# Altium project UZ_PER_SiC_inverter_828xcc.PrjPCB (part 1 of 2)
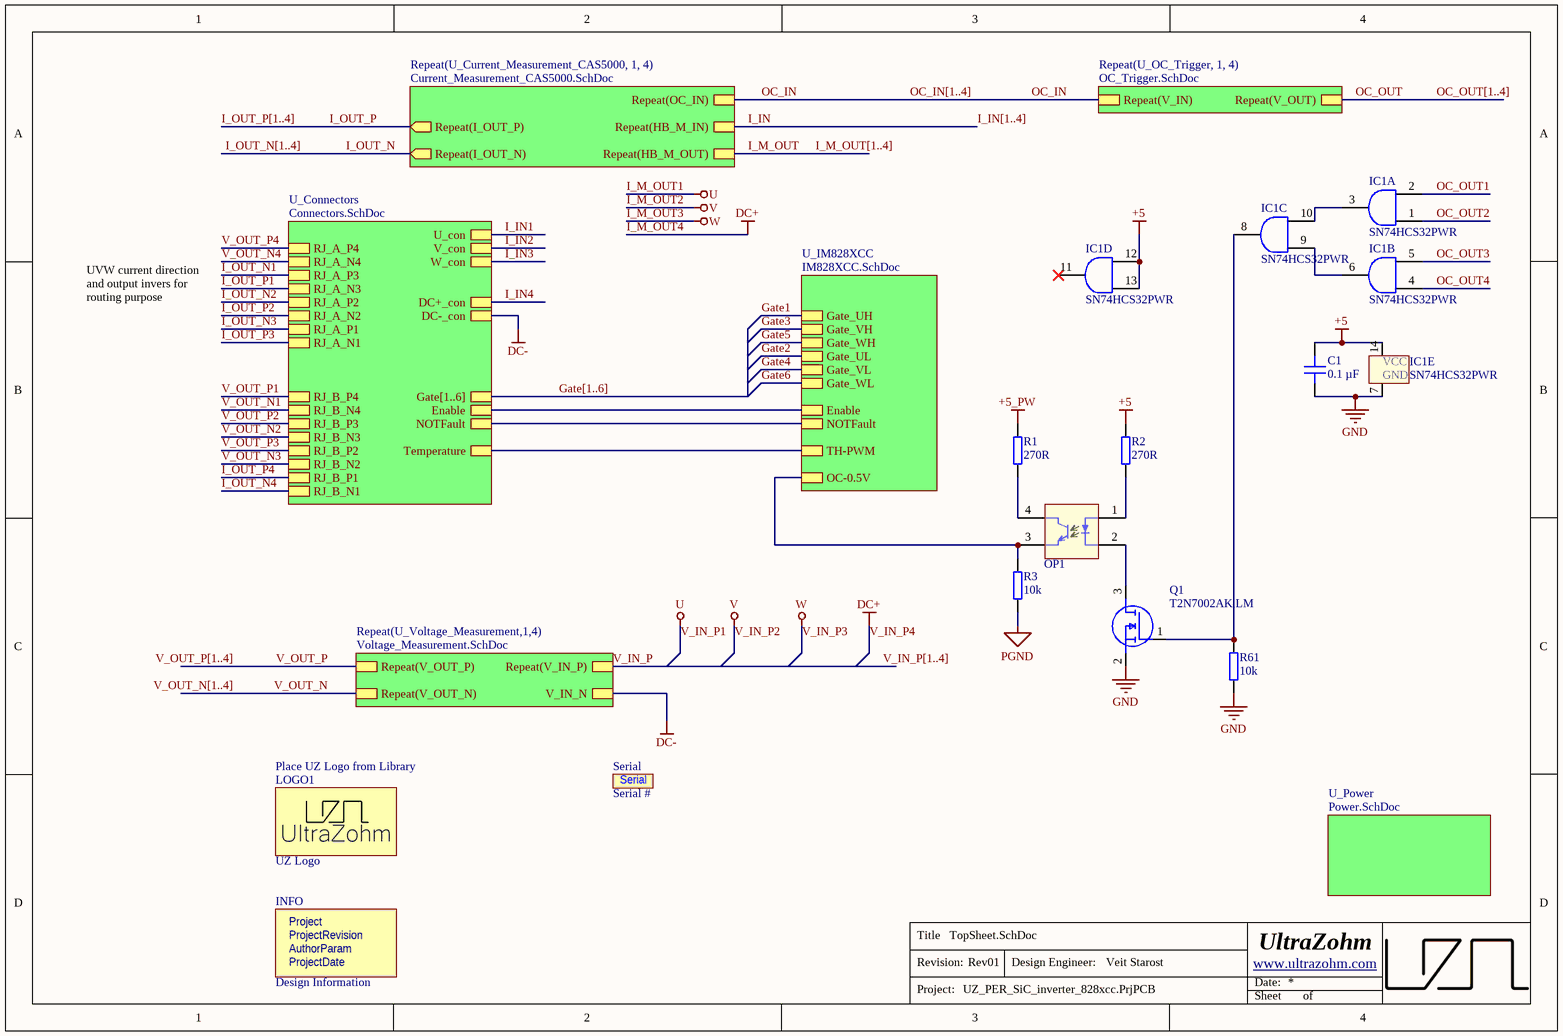
[diagram p0: TopSheet.SchDoc]
Author: Veit Starost; AuthorParam: Veit Starost; Project: UZ_PER_SiC_inverter_828xcc; ProjectDate: 02/2023; ProjectRevision: Rev01
9 sheets, 389 parts. Net scope: hierarchical (ports join the sheet entries above them; power ports are global).
Board file: UZ_PER_SiC_inverter_828xcc.PcbDoc
Sheets:
  TopSheet.SchDoc
    U_Power = Power.SchDoc
    U_IM828XCC = IM828XCC.SchDoc
    U_Current_Measurement_CAS50001 = Current_Measurement_CAS5000.SchDoc
    U_Current_Measurement_CAS50002 = Current_Measurement_CAS5000.SchDoc
    U_Current_Measurement_CAS50003 = Current_Measurement_CAS5000.SchDoc
    U_Current_Measurement_CAS50004 = Current_Measurement_CAS5000.SchDoc
    U_Connectors = Connectors.SchDoc
      Opt_RX_gate1 = Optical_RX.SchDoc
      Opt_RX_gate2 = Optical_RX.SchDoc
      Opt_RX_gate3 = Optical_RX.SchDoc
      Opt_RX_gate4 = Optical_RX.SchDoc
      Opt_RX_gate5 = Optical_RX.SchDoc
      Opt_RX_gate6 = Optical_RX.SchDoc
      Opt_TX_Fault = Optical_TX.SchDoc
      Opt_TX_Temp = Optical_TX.SchDoc
      Opt_RX_en = Optical_RX.SchDoc
    U_Voltage_Measurement1 = Voltage_Measurement.SchDoc
    U_Voltage_Measurement2 = Voltage_Measurement.SchDoc
    U_Voltage_Measurement3 = Voltage_Measurement.SchDoc
    U_Voltage_Measurement4 = Voltage_Measurement.SchDoc
    U_OC_Trigger1 = OC_Trigger.SchDoc
    U_OC_Trigger2 = OC_Trigger.SchDoc
    U_OC_Trigger3 = OC_Trigger.SchDoc
    U_OC_Trigger4 = OC_Trigger.SchDoc

## Sheet TopSheet.SchDoc
size A4; Author: Veit Starost; CompanyName: Technische Hochschule Nürnberg Georg Simon Ohm; Organization: UltraZohm; Address1: Kesslerplatz 12; Address2: 90489 Nürnberg; Address3: GERMANY; Website: www.ultrazohm.com

### Parts
C1  0.1 µF  [C_0603]
IC1  SN74HCS32PWR  [TSSOP-14]  (parts A,B,C,D,E of 5)
INFO  Design Information  [Design_info]  (no BOM)
LOGO1  UZ Logo  [UZ_Logo_small]  (no BOM)
OP1  VO617A-2X017T  [SMD4]  (value not drawn)
Q1  T2N7002AK,LM  [SOT-23-3]
R1  270R  [RES 0603_1608]
R2  270R  [RES 0603_1608]
R3  10k  [RES 0603_1608]
R61  10k  [RES 0603_1608]
Serial  Serial #  [SERIAL]  (no BOM)

### Sub-sheets
Repeat(U_Current_Measurement_CAS5000, 1, 4) = Current_Measurement_CAS5000.SchDoc: Repeat(HB_M_IN), Repeat(HB_M_OUT), Repeat(I_OUT_P) (out), Repeat(I_OUT_N) (out), Repeat(OC_IN)
Repeat(U_OC_Trigger, 1, 4) = OC_Trigger.SchDoc: Repeat(V_IN), Repeat(V_OUT)
Repeat(U_Voltage_Measurement,1,4) = Voltage_Measurement.SchDoc: Repeat(V_IN_P), V_IN_N, Repeat(V_OUT_N), Repeat(V_OUT_P)
U_Connectors = Connectors.SchDoc: Gate[1..6], Enable, Temperature, NOTFault, RJ_A_P4, RJ_A_N4, RJ_A_P3, RJ_A_N3, RJ_A_P2, RJ_A_N2, RJ_A_P1, RJ_A_N1, RJ_B_P4, RJ_B_N4, RJ_B_P3, RJ_B_N3, RJ_B_P2, RJ_B_N2, RJ_B_P1, RJ_B_N1, DC+_con, DC-_con, U_con, V_con, W_con
U_IM828XCC = IM828XCC.SchDoc: Gate_UL, Gate_VL, Gate_WL, Gate_WH, Gate_VH, Gate_UH, OC-0.5V, Enable, NOTFault, TH-PWM
U_Power = Power.SchDoc: no entries

### Nets
+5: C1.2 IC1.12 IC1.13 IC1.14 R2.2
+5_PW: R1.2
DC-: sheet U_Connectors/DC-_con, sheet Repeat(U_Voltage_Measurement,1,4)/V_IN_N
GND: C1.1 IC1.7 Q1.2(S) R61.1
PGND: R3.1
I_IN: sheet Repeat(U_Current_Measurement_CAS5000, 1, 4)/Repeat(HB_M_IN)
I_M_OUT: sheet Repeat(U_Current_Measurement_CAS5000, 1, 4)/Repeat(HB_M_OUT)
I_OUT_N: sheet Repeat(U_Current_Measurement_CAS5000, 1, 4)/Repeat(I_OUT_N)
I_OUT_P: sheet Repeat(U_Current_Measurement_CAS5000, 1, 4)/Repeat(I_OUT_P)
OC_IN: sheet Repeat(U_Current_Measurement_CAS5000, 1, 4)/Repeat(OC_IN), sheet Repeat(U_OC_Trigger, 1, 4)/Repeat(V_IN)
OC_OUT: sheet Repeat(U_OC_Trigger, 1, 4)/Repeat(V_OUT)
OC_OUT1: IC1.2
OC_OUT2: IC1.1
OC_OUT3: IC1.5
OC_OUT4: IC1.4
V_IN_P: sheet Repeat(U_Voltage_Measurement,1,4)/Repeat(V_IN_P)
V_OUT_N: sheet Repeat(U_Voltage_Measurement,1,4)/Repeat(V_OUT_N)
V_OUT_P: sheet Repeat(U_Voltage_Measurement,1,4)/Repeat(V_OUT_P)
NetC36_2: OP1.3 R3.2 ; sheet U_IM828XCC/OC-0.5V
NetIC1_3: IC1.3 IC1.10
NetIC1_6: IC1.6 IC1.9
NetIC1_8: IC1.8 Q1.1(G) R61.2
NetIC6_6: sheet U_IM828XCC/TH-PWM, sheet U_Connectors/Temperature
NetIC10G_4: sheet U_IM828XCC/Enable, sheet U_Connectors/Enable
NetIC11A_2: sheet U_IM828XCC/NOTFault, sheet U_Connectors/NOTFault
NetOP1_1: OP1.1 R2.1
NetOP1_2: OP1.2 Q1.3(D)
NetOP1_4: OP1.4 R1.1

Not connected (* = marked no-connect by the designer): IC1 11*

### Buses and harness runs
bus Gate[1..6] = sheet U_Connectors/Gate[1..6]
bus I_IN[1..4]
bus I_M_OUT[1..4]
bus I_OUT_N[1..4]
bus I_OUT_P[1..4]
bus OC_IN[1..4]
bus OC_OUT[1..4]
bus V_IN_P[1..4]
bus V_OUT_N[1..4]
bus V_OUT_P[1..4]

### Notes on the sheet
- UVW current direction and output invers for routing purpose
- (near LOGO1) Place UZ Logo from Library
- Title
- Revision:
- Design Engineer:
- Date:
- Project:
- Sheet
- of
- (in symbol Design Information) Project; ProjectRevision; AuthorParam; ProjectDate
- (in symbol SN74HCS32PWR, part E) VCC; GND

### Library data of the parts
C1 = C0603X104K5RAC7411: Capacitor 0603, 50 VDC, 0.1 µF, X7R; Manufacturer: KEMET; Tolerance: 10 %; Voltage Rating: 50 VDC; Created from: MGremer; Manufacturer Part Number: C0603X104K5RAC7411; PartID: 3; Created On: 20.12.2020 13:54:13; ComponentLink1Description: Datasheet; ComponentLink1URL: https://www.mouser.de/datasheet/2/212/1/KEM_C1013_X7R_FT_CAP_SMD-1103280.pdf; Component Type: Capacitor 0603; Device Package: 0603; Last Updated: 04.03.2021 09:24:28; Mounting Type: SMD; Operating Temperature: -55 - 125°C; Series: SMD Comm X7R Flex; Supplier 1: Mouser; Supplier Part Number 1: 80-C0603X104K5R7411; Supplier 2: LCSC; Supplier Part Number 2: C14663; Type: Capacitor; Value: 0.1 µF; Live Cycle Status: 1; LCSC Part Number: C14663; Stock number: Labor SMD Container
IC1 = SN74HCS32PWR: Logische Gatter Quadruple 2-input OR gates with Schmitt-trigger inputs 14-TSSOP -40 to 125; Manufacturer: Texas Instruments; Value: 6 V; Created from: VStarost; Manufacturer Part Number: SN74HCS32PWR; PartID: 5; Created On: 31.01.2023 11:53:14; ComponentLink1Description: Datasheet; ComponentLink1URL: https://www.ti.com/lit/ds/symlink/sn74hcs32.pdf?HQS=dis-mous-null-mousermode-dsf-pf-null-wwe&ts=1675161071566&ref_url=https%253A%252F%252Fwww.mouser.de%252F; Component Type: OR; Device Package: TSSOP-14; Last Updated: 31.01.2023 11:53:14; Mounting Type: SMD; Operating Temperature: -40 - 125 °C; Series: SN74HCS32; Supplier 1: Mouser; Supplier Part Number 1: 595-SN74HCS32PWR; Type: OR; Live Cycle Status: 1; Stock number: not stored
INFO = Design Information: Manufacturer: UltraZohm; Created from: MGremer; Manufacturer Part Number: Design Information; PartID: 12; Created On: 03.11.2021 09:04:23; ComponentLink1Description: https://docs.ultrazohm.com/; ComponentLink1URL: homepage; Component Type: Design Information; Last Updated: 03.11.2021 09:28:34; Supplier 1: -; Supplier Part Number 1: -; Type: Design Information; Value: Design Information; Live Cycle Status: 1
LOGO1 = Logo small: Manufacturer: UltraZohm; Created from: MGremer; Created: Jan2021_Liegmann; Value: Logo; Manufacturer Part Number: Logo small; PartID: 10; Created On: 03.11.2021 09:04:23; ComponentLink1Description: https://docs.ultrazohm.com/; ComponentLink1URL: homepage; Component Type: Logo; Last Updated: 03.11.2021 09:05:50; Supplier 1: -; Supplier Part Number 1: -; Type: Logo; Live Cycle Status: 1
OP1 = VO617A-2X017T: Transistor-Ausgangsoptokoppler H. Relblty 5300 Vrms 63-125% CTR, VDE; Manufacturer: Vishay; Channels: 1; Created from: VStarost; Manufacturer Part Number: VO617A-2X017T; PartID: 4; Created On: 31.01.2023 09:27:11; ComponentLink1Description: Datasheet; ComponentLink1URL: https://www.mouser.de/datasheet/2/427/vo617a-1766974.pdf; Component Type: Optokoppler; Last Updated: 31.01.2023 09:27:11; Mounting Type: SMD; Operating Temperature: -55 - +110 °C; Supplier 1: Mouser; Supplier Part Number 1: 78-VO617A-2X017T; Type: Optokoppler; Live Cycle Status: 1
Q1 = T2N7002AK,LM: Small-signal MOSFET, n-Channel, 200 mA, 60 V; Manufacturer: Toshiba; Type: Power MOSFET; Value: 60 V; Created from: VStarost; Manufacturer Part Number: T2N7002AK,LM; PartID: 4; Created On: 24.01.2023 08:00:45; ComponentLink1Description: Datasheet; ComponentLink1URL: https://toshiba.semicon-storage.com/info/T2N7002AK_datasheet_en_20150401.pdf?did=29712&prodName=T2N7002AK; Component Type: Small-signal MOSFET; Device Package: SOT-23-3; Last Updated: 15.02.2023 18:16:19; Mounting Type: SMD; Operating Temperature: -55 - 150 °C; Series: T2N7002; Supplier 1: Mouser; Supplier Part Number 1: 757-T2N7002AKLM; Supplier 2: Digi-Key; Supplier Part Number 2: T2N7002AKLMCT-ND; Live Cycle Status: 1; Stock number: not stored; LCSC Part Number: C516175
R1 R2 = RK73B1JTTDD271J: SMD resistor E24 series; Manufacturer: KOA Speer; Tolerance: 5%; Created from: MGremer; Manufacturer Part Number: RK73B1JTTDD271J; PartID: 60; Created On: 14.12.2020 16:17:14; ComponentLink1Description: Datasheet; ComponentLink1URL: https://www.mouser.de/datasheet/2/219/RK73B-1825463.pdf; Component Type: SMD resistor; Device Package: 0603; Last Updated: 15.02.2023 17:43:45; Mounting Type: SMD; Supplier 1: Mouser; Supplier Part Number 1: 660-RK73B1JTTDD271J; Type: Resistor; Value: 270R; Live Cycle Status: 1; Stock number: Labor SMD Container; LCSC Part Number: C177305
R3 R61 = MCWR06X1002FTL: SMD resistor 1%; Manufacturer: Multicomp PRO; Created from: MGremer; Manufacturer Part Number: MCWR06X1002FTL; PartID: 176; Created On: 14.12.2020 16:17:14; ComponentLink1Description: Datasheet; ComponentLink1URL: http://www.farnell.com/datasheets/2860681.pdf; Component Type: SMD resistor; Device Package: 0603; Last Updated: 15.02.2023 17:53:17; Mounting Type: SMD; Supplier 1: Farnell; Supplier Part Number 1: 2447230; Type: Resistor; Tolerance: 1%; Value: 10k; Live Cycle Status: 1; Stock number: not stored; LCSC Part Number: C269701
Serial = SerialNumber: Empty serial number of the PCB. Can be used for manually writing the serial number

## Sheet Power.SchDoc
size A4; Author: Veit Starost; CompanyName: Technische Hochschule Nürnberg Georg Simon Ohm; Organization: UltraZohm; Address1: Kesslerplatz 12; Address2: 90489 Nürnberg; Address3: GERMANY; Website: www.ultrazohm.com
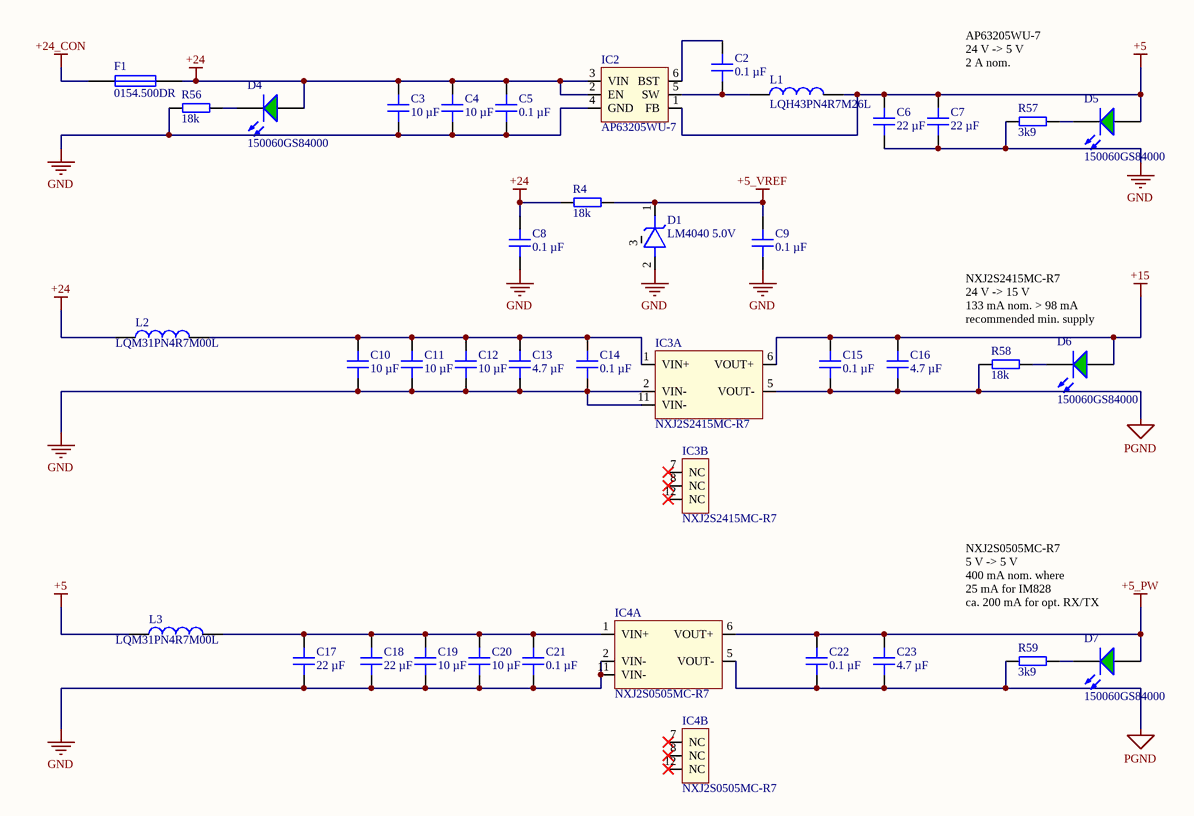
[diagram p1: Power.SchDoc]

### Parts
C2  0.1 µF  [C_0603]
C3  10 µF  [C_1206]
C4  10 µF  [C_1206]
C5  0.1 µF  [C_0603]
C6  22 µF  [C_1206]
C7  22 µF  [C_1206]
C8  0.1 µF  [C_0603]
C9  0.1 µF  [C_0603]
C10  10 µF  [C_1206]
C11  10 µF  [C_1206]
C12  10 µF  [C_1206]
C13  4.7 µF  [C_0805]
C14  0.1 µF  [C_0603]
C15  0.1 µF  [C_0603]
C16  4.7 µF  [C_0805]
C17  22 µF  [C_1206]
C18  22 µF  [C_1206]
C19  10 µF  [C_1206]
C20  10 µF  [C_1206]
C21  0.1 µF  [C_0603]
C22  0.1 µF  [C_0603]
C23  4.7 µF  [C_0805]
D1  LM4040 5.0V  [SOT-23-3]
D4  150060GS84000  [WL-SMCW_0603]
D5  150060GS84000  [WL-SMCW_0603]
D6  150060GS84000  [WL-SMCW_0603]
D7  150060GS84000  [WL-SMCW_0603]
F1  0154.500DR  [Littlefuse_154]
IC2  AP63205WU-7  [TSOT26-6]
IC3  NXJ2S2415MC-R7  [DCDC]  (parts A,B of 2)
IC4  NXJ2S0505MC-R7  [DCDC]  (parts A,B of 2)
L1  LQH43PN4R7M26L  [IND]
L2  LQM31PN4R7M00L  [IND 1206_3216]
L3  LQM31PN4R7M00L  [IND 1206_3216]
R4  18k  [RES 0603_1608]
R56  18k  [RES 0603_1608]
R57  3k9  [RES 0603_1608]
R58  18k  [RES 0603_1608]
R59  3k9  [RES 0603_1608]

### Nets
+5: C6.2 C7.2 D5.2(A) IC2.1(FB) L1.2 L3.1
+5_PW: C22.2 C23.2 D7.2(A) IC4.6(VOUT+)
+5_VREF: C9.2 D1.1(K) R4.2
+15: C15.2 C16.2 D6.2(A) IC3.6(VOUT+)
+24: C3.2 C4.2 C5.2 C8.2 D4.2(A) F1.2 IC2.2(EN) IC2.3(VIN) L2.1 R4.1
+24_CON: F1.1
GND: C3.1 C4.1 C5.1 C6.1 C7.1 C8.1 C9.1 C10.1 C11.1 C12.1 C13.1 C14.1 C17.1 C18.1 C19.1 C20.1 C21.1 D1.2(A) IC2.4(GND) IC3.2(VIN-) IC3.11(VIN-) IC4.2(VIN-) IC4.11(VIN-) R56.1 R57.1
PGND: C15.1 C16.1 C22.1 C23.1 IC3.5(VOUT-) IC4.5(VOUT-) R58.1 R59.1
NetC2_1: C2.1 IC2.5(SW) L1.1
NetC2_2: C2.2 IC2.6(BST)
NetC10_2: C10.2 C11.2 C12.2 C13.2 C14.2 IC3.1(VIN+) L2.2
NetC17_2: C17.2 C18.2 C19.2 C20.2 C21.2 IC4.1(VIN+) L3.2
NetD4_1: D4.1(K) R56.2
NetD5_1: D5.1(K) R57.2
NetD6_1: D6.1(K) R58.2
NetD7_1: D7.1(K) R59.2

Not connected (* = marked no-connect by the designer): D1 3(NC); IC3 7(NC)* 8(NC)* 12(NC)*; IC4 7(NC)* 8(NC)* 12(NC)*

### Notes on the sheet
- AP63205WU-7
  24 V -> 5 V
  2 A nom.
- NXJ2S2415MC-R7
  24 V -> 15 V
  133 mA nom. > 98 mA
  recommended min. supply
- NXJ2S0505MC-R7
  5 V -> 5 V
  400 mA nom. where
  25 mA for IM828
  ca. 200 mA for opt. RX/TX
- Title
- Revision:
- Design Engineer:
- Date:
- Project:
- Sheet
- of

### Library data of the parts
C2 C5 C8 C9 C14 C15 C21 C22 = C0603X104K5RAC7411: as C1 on sheet TopSheet; Manufacturer Part Number: C0603X104K5RAC7411; PartID: 3; Created On: 20.12.2020 13:54:13; ComponentLink1Description: Datasheet; ComponentLink1URL: https://www.mouser.de/datasheet/2/212/1/KEM_C1013_X7R_FT_CAP_SMD-1103280.pdf; Component Type: Capacitor 0603; Device Package: 0603; Last Updated: 04.03.2021 09:24:28; Mounting Type: SMD; Operating Temperature: -55 - 125°C; Series: SMD Comm X7R Flex; Supplier 1: Mouser; Supplier Part Number 1: 80-C0603X104K5R7411; Supplier 2: LCSC; Supplier Part Number 2: C14663; Type: Capacitor; Value: 0.1 µF; Live Cycle Status: 1; LCSC Part Number: C14663; Stock number: Labor SMD Container
C3 C4 C10-C12 C19 C20 = CGA5L1X7R1H106K160AC: Capacitor 1206, 50 VDC, 10 µF, X7R; Manufacturer: TDK; Tolerance: 10 %; Voltage Rating: 50 VDC; Created from: MGremer; Manufacturer Part Number: CGA5L1X7R1H106K160AC; PartID: 25; Created On: 20.12.2020 13:54:13; ComponentLink1Description: Datasheet; ComponentLink1URL: https://product.tdk.com/info/en/catalog/datasheets/mlcc_automotive_general_en.pdf; Component Type: Capacitor 1206; Device Package: 1206; Last Updated: 27.05.2022 14:15:21; Mounting Type: SMD; Operating Temperature: -55 - 125°C; Series: CGA; Supplier 1: Mouser; Supplier Part Number 1: 810-CGA5L1X7R1H106K1; Type: Capacitor; Value: 10 µF; Live Cycle Status: 1; LCSC Part Number: C13585; Stock number: Labor SMD Container
C6 C7 C17 C18 = C3216X5R1V226M160AC: Capacitor 1206, 35 VDC, 22µF, X5R; Manufacturer: TDK; Tolerance: 20 %; Voltage Rating: 35 VDC; Created from: VStarost; Manufacturer Part Number: C3216X5R1V226M160AC; PartID: 116; Created On: 14.12.2022 12:32:58; ComponentLink1Description: Datasheet; ComponentLink1URL: https://product.tdk.com/system/files/dam/doc/product/capacitor/ceramic/mlcc/catalog/mlcc_commercial_general_en.pdf; Component Type: Capacitor 1206; Device Package: 1206; Last Updated: 14.12.2022 12:38:27; Mounting Type: SMD; Operating Temperature: -55 - 85°C; Series: C; Supplier 1: Mouser; Supplier Part Number 1: 810-C3216X5R1V226M; Type: Capacitor; Value: 22 µF; Live Cycle Status: 1; Stock number: KA126
C13 C16 C23 = C2012X7R1H475K125AC: Capacitor 0805, 50 VDC, 4.7 µF, X7R; Manufacturer: TDK; Tolerance: 10 %; Voltage Rating: 50 VDC; Created from: MGremer; Manufacturer Part Number: C2012X7R1H475K125AC; PartID: 15; Created On: 20.12.2020 13:54:13; ComponentLink1Description: Datasheet; ComponentLink1URL: https://product.tdk.com/info/en/catalog/datasheets/mlcc_commercial_general_en.pdf; Component Type: Capacitor 0805; Device Package: 0805; Last Updated: 20.12.2020 16:34:30; Mounting Type: SMD; Operating Temperature: -55 - 125°C; Series: C; Supplier 1: Mouser; Supplier Part Number 1: 810-C2012X7R475K125C; Type: Capacitor; Value: 4.7 µF; Live Cycle Status: 1; Stock number: Labor SMD Container
D1 = LM4040CIM3-5.0+T: Voltage Reference, 5.0V, ±0.5%, ±15mA; Manufacturer: Analog Devices; Created from: VStarost; Manufacturer Part Number: LM4040CIM3-5.0+T; PartID: 13; Created On: 02.02.2023 11:02:52; ComponentLink1Description: Datasheet; ComponentLink1URL: https://www.mouser.de/datasheet/2/256/LM4040-LM4040D-962257.pdf; Component Type: Voltage Reference; Device Package: SMD; Last Updated: 02.02.2023 11:02:52; Mounting Type: SMD; Operating Temperature: -40 - 85 °C; Series: LM4040C; Supplier 1: Mouser; Supplier Part Number 1: 700-LM4040CIM3-5.0T; Type: Voltage Reference; Value: LM4040 5.0V; Live Cycle Status: 1; Stock number: not stored
D4-D7 = 150060GS84000: WL-SMCW SMD Mono-color Chip LED Waterclear Green; Manufacturer: Wuerth Elektronik; Type: Standard; Created from: MGremer; Forward Current I_f: 20 mA; Forward Voltage U_f: 3.2 V; Wavelength: 525 nm; Light Intensity: 3000 mcd; Nominal Power: 78 mW; Manufacturer Part Number: 150060GS84000; PartID: 2; Created On: 08.12.2020 10:41:11; ComponentLink1Description: Datasheet; ComponentLink1URL: https://www.mouser.de/datasheet/2/445/150060GS75020-1714345.pdf; Component Type: LED Diode; Device Package: 0603; Last Updated: 03.03.2021 09:59:51; Mounting Type: SMD; Operating Temperature: -40 - 85 °C; Supplier 1: Mouser; Supplier Part Number 1: 710-150060GS84000; Supplier 2: Farnell; Supplier Part Number 2: 3408612; Supplier 3: Digi-Key; Supplier Part Number 3: 732-150060GS84000CT-ND; Live Cycle Status: 1; Stock number: not stored; Color: green
F1 = 0154.500DR: Fuse OMNI BLOK 154; Manufacturer: Littlefuse; Nominal current: 500 mA; Nominal voltage AC: 125 VAC; Nominal voltage DC: 125 VDC; Resistance: 304.6 mOhm; Value: 500 mA; Created from: MGremer; Manufacturer Part Number: 0154.500DR; PartID: 2; Created On: 07.01.2021 10:17:19; ComponentLink1Description: Datasheet; ComponentLink1URL: https://www.mouser.de/datasheet/2/240/Littelfuse_Fuse_154_154T_154L_154TL_Datasheet_pdf-365375.pdf; Component Type: NAN02 - 154 OMNI-BLOK; Device Package: OMNI-BLOK; Last Updated: 07.01.2021 10:22:49; Mounting Type: SMD; Operating Temperature: -55 - 125 °C; Series: 154; Supplier 1: Mouser; Supplier Part Number 1: 576-0154.500DR; Type: Fuse; Live Cycle Status: 1
IC2 = AP63205WU-7: Switching Voltage Regulators DCDC Conv HV Buck TSOT26 T&R 3K; Manufacturer: Diodes Incorporate; Created from: VStarost; Manufacturer Part Number: AP63205WU-7; PartID: 2; Created On: 13.12.2022 12:26:50; ComponentLink1Description: Datasheet; ComponentLink1URL: https://www.mouser.de/datasheet/2/115/DIOD_S_A0007089856_1-2542907.pdf; Component Type: Buck Converter; Last Updated: 13.12.2022 12:26:50; Mounting Type: SMD; Operating Temperature: -40 - 85 °C; Supplier 1: Mouser; Supplier Part Number 1: 621-AP63205WU-7; Type: Switching Regulator; Live Cycle Status: 1; Stock number: not stored
IC3 = NXJ2S2415MC-R7: Isolated DC/DC Converters - SMD 21.6V TO 26.4V IN 15V OUT; Manufacturer: Murata; Value: 2 W; Created from: VStarost; Manufacturer Part Number: NXJ2S2415MC-R7; PartID: 25; Created On: 13.12.2022 13:30:59; ComponentLink1Description: Datasheet; ComponentLink1URL: https://www.mouser.de/datasheet/2/281/1/kdc_nxj2-2941192.pdf; Component Type: DC-DC Converter; Device Package: -; Last Updated: 13.12.2022 13:30:59; Mounting Type: SMD; Operating Temperature: -40 - 85 °C; Series: NXJ2; Supplier 1: Mouser; Supplier Part Number 1: 580-NXJ2S2415MC-R7; Type: isolated DC-DC Converter; Live Cycle Status: 1; Stock number: not stored
IC4 = NXJ2S0505MC-R7: Isolated DC/DC Converters - SMD 4.5V TO 5.5V IN 5V OUT; Manufacturer: Murata; Value: 2 W; Created from: VStarost; Manufacturer Part Number: NXJ2S0505MC-R7; PartID: 26; Created On: 21.12.2022 14:43:56; ComponentLink1Description: Datasheet; ComponentLink1URL: https://www.murata.com/products/productdata/8807031996446/kdc-nxj2.pdf; Component Type: DC-DC Converter; Device Package: -; Last Updated: 21.12.2022 14:43:56; Mounting Type: SMD; Series: NXJ2; Supplier 1: Digi-Key; Supplier Part Number 1: 811-3818-1-ND; Type: isolated DC-DC Converter; Live Cycle Status: 1; Stock number: not stored
L1 = LQH43PN4R7M26L: Leistungsinduktivitäten – SMD 4.7 UH 20%; Manufacturer: Murata; MF: EPCOS / TDK; Value: 4.7 uH; DCR: 320m; Rated Current: 0.85 A; Type: Inductance SMD; DC current: 1.4 A; Created from: VStarost; MPN: B82464G4154M; Supplier 1: Mouser; Supplier Part Number 1: 81-LQH43PN4R7M26L; Manufacturer Part Number: LQH43PN4R7M26L; PartID: 15; Created On: 31.01.2023 09:01:23; ComponentLink1Description: Datasheet; ComponentLink1URL: https://www.mouser.de/datasheet/2/281/JELF243A_0093-1517796.pdf; Component Type: Inductance; Device Package: 1812; Last Updated: 31.01.2023 09:02:10; Mounting Type: SMD; Operating Temperature: -40 - 85 °C; Series: LQH; Live Cycle Status: 1; Stock number: not stored
L2 L3 = LQM31PN4R7M00L: Power Inductors - SMD 4.7 UH 20%; Manufacturer: Murata; MF: EPCOS / TDK; Value: 4.7 uH; DCR: 320m; Rated Current: 0.85 A; Type: Inductance SMD; DC current: 700 mA; Created from: VStarost; MPN: B82464G4154M; Supplier 1: Mouser; Supplier Part Number 1: 81-LQM31PN4R7M00L; Manufacturer Part Number: LQM31PN4R7M00L; PartID: 14; Created On: 21.12.2022 14:39:27; ComponentLink1Description: Datasheet; ComponentLink1URL: https://www.mouser.de/datasheet/2/281/1/JELF243B_0013-1634236.pdf; Component Type: Inductance; Device Package: 1206; Last Updated: 15.02.2023 18:04:47; Mounting Type: SMD; Operating Temperature: -55 - 125 °C; Series: LQM; Live Cycle Status: 1; Stock number: not stored; LCSC Part Number: C162588
R4 R56 R58 = RK73B1JTTD183J: SMD resistor E24 series; Manufacturer: KOA Speer; Tolerance: 5%; Created from: MGremer; Manufacturer Part Number: RK73B1JTTD183J; PartID: 104; Created On: 14.12.2020 16:17:14; ComponentLink1Description: Datasheet; ComponentLink1URL: https://www.mouser.de/datasheet/2/219/RK73B-1825463.pdf; Component Type: SMD resistor; Device Package: 0603; Last Updated: 15.02.2023 17:57:37; Mounting Type: SMD; Supplier 1: Mouser; Supplier Part Number 1: 660-RK73B1JTTD183J; Type: Resistor; Value: 18k; Live Cycle Status: 1; Stock number: Labor SMD Container; LCSC Part Number: C177285
R57 R59 = RK73B1JTTDD392J: SMD resistor E24 series; Manufacturer: KOA Speer; Tolerance: 5%; Created from: MGremer; Manufacturer Part Number: RK73B1JTTDD392J; PartID: 88; Created On: 14.12.2020 16:17:14; ComponentLink1Description: Datasheet; ComponentLink1URL: https://www.mouser.de/datasheet/2/219/RK73B-1825463.pdf; Component Type: SMD resistor; Device Package: 0603; Last Updated: 15.02.2023 17:47:58; Mounting Type: SMD; Supplier 1: Mouser; Supplier Part Number 1: 660-RK73B1JTTDD392J; Type: Resistor; Value: 3k9; Live Cycle Status: 1; Stock number: Labor SMD Container; LCSC Part Number: C177310

## Sheet IM828XCC.SchDoc
size A4; Author: Veit Starost; CompanyName: Technische Hochschule Nürnberg Georg Simon Ohm; Organization: UltraZohm; Address1: Kesslerplatz 12; Address2: 90489 Nürnberg; Address3: GERMANY; Website: www.ultrazohm.com
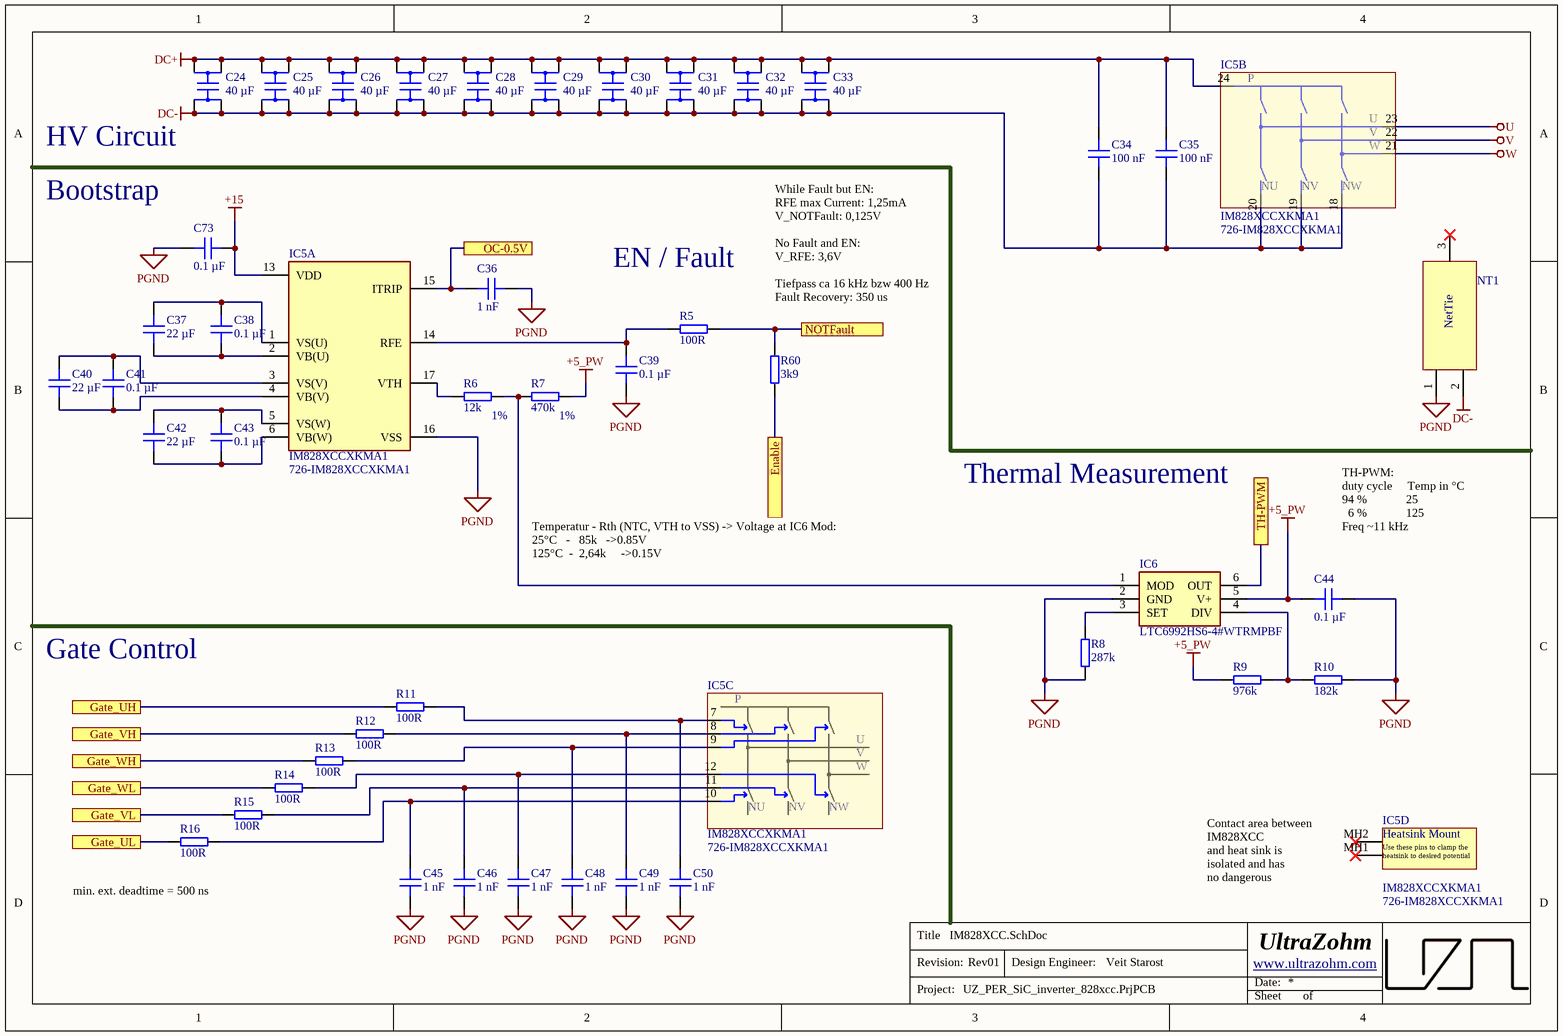
[diagram p2: IM828XCC.SchDoc]

### Parts
C24  40 µF  [B32778Z]
C25  40 µF  [B32778Z]
C26  40 µF  [B32778Z]
C27  40 µF  [B32778Z]
C28  40 µF  [B32778Z]
C29  40 µF  [B32778Z]
C30  40 µF  [B32778Z]
C31  40 µF  [B32778Z]
C32  40 µF  [B32778Z]
C33  40 µF  [B32778Z]
C34  100 nF  [WIMA]
C35  100 nF  [WIMA]
C36  1 nF  [C_0603]
C37  22 µF  [C_1206]
C38  0.1 µF  [C_0603]
C39  0.1 µF  [C_0603]
C40  22 µF  [C_1206]
C41  0.1 µF  [C_0603]
C42  22 µF  [C_1206]
C43  0.1 µF  [C_0603]
C44  0.1 µF  [C_0603]
C45  1 nF  [C_0603]
C46  1 nF  [C_0603]
C47  1 nF  [C_0603]
C48  1 nF  [C_0603]
C49  1 nF  [C_0603]
C50  1 nF  [C_0603]
C73  0.1 µF  [C_0603]
IC5  IM828XCCXKMA1  Supplier Part Number 1: 726-IM828XCCXKMA1  [IM828XCCXKMA1]  (parts A,B,C,D of 4)
IC6  LTC6992HS6-4#WTRMPBF  [SOT95P280X100-6N]
NT1  Net Tie 2 to 1  [2_to_1_NetTie_1mm]  (value not drawn)  (net tie, no BOM)
R5  100R  [RES 0603_1608]
R6  12k  Tolerance: 1%  [RES 0603_1608]
R7  470k  Tolerance: 1%  [RES 0603_1608]
R8  287k  [RES 0805_2012]
R9  976k  [RES 0603_1608]
R10  182k  [RES 0603_1608]
R11  100R  [RES 0603_1608]
R12  100R  [RES 0603_1608]
R13  100R  [RES 0603_1608]
R14  100R  [RES 0603_1608]
R15  100R  [RES 0603_1608]
R16  100R  [RES 0603_1608]
R60  3k9  [RES 0603_1608]

### Ports
Enable, Gate_UH, Gate_UL, Gate_VH, Gate_VL, Gate_WH, Gate_WL, NOTFault, OC-0.5V, TH-PWM

### Nets
+5_PW: C44.2 IC6.5(V+) R7.2 R9.1
+15: C73.1 IC5.13(VDD)
DC+: C24.2 C24.3 C25.2 C25.3 C26.2 C26.3 C27.2 C27.3 C28.2 C28.3 C29.2 C29.3 C30.2 C30.3 C31.2 C31.3 C32.2 C32.3 C33.2 C33.3 C34.2 C35.2 IC5.24(P)  [project net I_M_OUT4]
DC-: C24.1 C24.4 C25.1 C25.4 C26.1 C26.4 C27.1 C27.4 C28.1 C28.4 C29.1 C29.4 C30.1 C30.4 C31.1 C31.4 C32.1 C32.4 C33.1 C33.4 C34.1 C35.1 IC5.18(NW) IC5.19(NV) IC5.20(NU) NT1.2
PGND: C36.1 C39.1 C44.1 C45.1 C46.1 C47.1 C48.1 C49.1 C50.1 C73.2 IC5.16(VSS) IC6.2(GND) NT1.1 R8.1 R10.2
U: IC5.23(U)  [project net I_M_OUT1]
V: IC5.22(V)  [project net I_M_OUT2]
W: IC5.21(W)  [project net I_M_OUT3]
Gate1: R11.1 ; port Gate_UH
Gate2: R16.1 ; port Gate_UL
Gate3: R12.1 ; port Gate_VH
Gate4: R15.1 ; port Gate_VL
Gate5: R13.1 ; port Gate_WH
Gate6: R14.1 ; port Gate_WL
NetC36_2: C36.2 IC5.15(ITRIP) ; port OC-0.5V
NetC37_1: C37.1 C38.1 IC5.2(VB(U))
NetC37_2: C37.2 C38.2 IC5.1(VS(U))
NetC39_2: C39.2 IC5.14(RFE) R5.1
NetC40_1: C40.1 C41.1 IC5.4(VB(V))
NetC40_2: C40.2 C41.2 IC5.3(VS(V))
NetC42_1: C42.1 C43.1 IC5.6(VB(W))
NetC42_2: C42.2 C43.2 IC5.5(VS(W))
NetC45_2: C45.2 IC5.10(LIN(U)) R16.2
NetC46_2: C46.2 IC5.11(LIN(V)) R15.2
NetC47_2: C47.2 IC5.12(LIN(W)) R14.2
NetC48_2: C48.2 IC5.9(HIN(W)) R13.2
NetC49_2: C49.2 IC5.8(HIN(V)) R12.2
NetC50_2: C50.2 IC5.7(HIN(U)) R11.2
NetIC5_17: IC5.17(VTH) R6.1
NetIC6_1: IC6.1(MOD) R6.2 R7.1
NetIC6_3: IC6.3(SET) R8.2
NetIC6_4: IC6.4(DIV) R9.2 R10.1
NetIC6_6: IC6.6(OUT) ; port TH-PWM
NetIC10G_4: R60.1 ; port Enable
NetIC11A_2: R5.2 R60.2 ; port NOTFault

Not connected (* = marked no-connect by the designer): IC5 MH1(HeatsinkScrew)* MH2(HeatsinkScrew2)*; NT1 3*

### Notes on the sheet
- (near C24) HV Circuit
- (near C73) Bootstrap
- EN / Fault
- (near R60) While Fault but EN:
  RFE max Current: 1,25mA
  V_NOTFault: 0,125V
  No Fault and EN:
  V_RFE: 3,6V
  Tiefpass ca 16 kHz bzw 400 Hz
  Fault Recovery: 350 us
- Thermal Measurement
- Temperatur - Rth (NTC, VTH to VSS) -> Voltage at IC6 Mod:
  25°C   -   85k   ->0.85V
  125°C  -  2,64k     ->0.15V
- (near C44) TH-PWM:
  duty cycle     Temp in °C
  94 %             25
  6 %             125
  Freq ~11 kHz
- Gate Control
- (near R16) min. ext. deadtime = 500 ns
- Contact area between IM828XCC
  and heat sink is isolated and has
  no dangerous potential
- Title
- Revision:
- Design Engineer:
- Date:
- Project:
- Sheet
- of
- (in symbol IM828XCCXKMA1, part D) Heatsink Mount; Use these pins to clamp the heatsink to desired potential
- (in symbol Net Tie 2 to 1) NetTie

### Library data of the parts
C24-C33 = B32778Z0406K000: Film Capacitors, 40 µF, 1000 VDC for DC Link; Manufacturer: EPCOS / TDK; Tolerance: 10%; Created from: VStarost; Manufacturer Part Number: B32778Z0406K000; PartID: 6; Created On: 14.12.2022 12:52:42; ComponentLink1Description: Datasheet; ComponentLink1URL: https://product.tdk.com/system/files/dam/doc/product/capacitor/film/mkp_mfp/data_sheet/20/20/ds/mkp_b32774xyz_778xyz.pdf; Component Type: Capacitor; Device Package: THT; Last Updated: 14.12.2022 12:52:42; Mounting Type: THT; Operating Temperature: -40 - 105°C; Series: B3277_X/Y/Z; Supplier 1: Mouser; Supplier Part Number 1: 871-B32778Z0406K000; Type: Capacitor; Voltage Rating: 1000 VDC; Value: 40 µF; Live Cycle Status: 1; Stock number: not stored
C34 C35 = MKP1T031006B00KYSD: Folienkondensatoren 1600V .10uF 10% PCM 27.5; Voltage Rating: 1600 VDC; Created from: VStarost; Manufacturer Part Number: MKP1T031006B00KYSD; PartID: 7; Created On: 02.02.2023 13:58:40; ComponentLink1Description: DatasheetDatasheet; ComponentLink1URL: https://www.mouser.de/datasheet/2/440/e_WIMA_MKP_10-1139811.pdf; Component Type: Capacitor; Device Package: THT; Last Updated: 02.02.2023 14:01:18; Manufacturer: WIMA; Mounting Type: THT; Operating Temperature: -55 - 100°C; Series: MKP10; Supplier 1: Mouser; Supplier Part Number 1: 505-M10.1/1600/10P; Type: Capacitor; Tolerance: 10%; Value: 100 nF; Live Cycle Status: 1; Stock number: not stored
C36 C45-C50 = 06035A102JAT2A: Capacitor 0603, 50 VDC, 1 nF, C0G; Manufacturer: AVX; Tolerance: 5 %; Voltage Rating: 50 VDC; Created from: MGremer; Manufacturer Part Number: 06035A102JAT2A; PartID: 57; Created On: 20.12.2020 13:54:13; ComponentLink1Description: Datasheet; ComponentLink1URL: https://www.mouser.de/datasheet/2/40/C0GNP0_Dielectric-951274.pdf; Component Type: Capacitor 0603; Device Package: 0603; Last Updated: 15.02.2023 13:44:24; Mounting Type: SMD; Operating Temperature: -55 - 125°C; Series: C0G; Supplier 1: Mouser; Supplier Part Number 1: 581-06035A102J; Type: Capacitor; Value: 1 nF; Live Cycle Status: 1; Stock number: not stored; LCSC Part Number: C106246
C37 C40 C42 = C3216X5R1V226M160AC: as C6 on sheet Power; Manufacturer Part Number: C3216X5R1V226M160AC; PartID: 116; Created On: 14.12.2022 12:32:58; ComponentLink1Description: Datasheet; ComponentLink1URL: https://product.tdk.com/system/files/dam/doc/product/capacitor/ceramic/mlcc/catalog/mlcc_commercial_general_en.pdf; Component Type: Capacitor 1206; Device Package: 1206; Last Updated: 14.12.2022 12:38:27; Mounting Type: SMD; Operating Temperature: -55 - 85°C; Series: C; Supplier 1: Mouser; Supplier Part Number 1: 810-C3216X5R1V226M; Type: Capacitor; Value: 22 µF; Live Cycle Status: 1; Stock number: KA126
C38 C39 C41 C43 C44 C73 = C0603X104K5RAC7411: as C1 on sheet TopSheet; Manufacturer Part Number: C0603X104K5RAC7411; PartID: 3; Created On: 20.12.2020 13:54:13; ComponentLink1Description: Datasheet; ComponentLink1URL: https://www.mouser.de/datasheet/2/212/1/KEM_C1013_X7R_FT_CAP_SMD-1103280.pdf; Component Type: Capacitor 0603; Device Package: 0603; Last Updated: 04.03.2021 09:24:28; Mounting Type: SMD; Operating Temperature: -55 - 125°C; Series: SMD Comm X7R Flex; Supplier 1: Mouser; Supplier Part Number 1: 80-C0603X104K5R7411; Supplier 2: LCSC; Supplier Part Number 2: C14663; Type: Capacitor; Value: 0.1 µF; Live Cycle Status: 1; LCSC Part Number: C14663; Stock number: Labor SMD Container
IC5 = IM828XCCXKMA1: Motor/Motion/Ignition Controllers & Drivers SiC MOSFET; Manufacturer_Name: Infineon; Value: 900V 20A; Created from: VStarost; Datasheet Link: https://www.infineon.com/dgdl/Infineon-IM828-XCC-DataSheet-v02_00-EN.pdf?fileId=5546d4627448fb2b0174583d4d6d430c; Height: 5.6mm; Manufacturer_Part_Number: IM828XCCXKMA1; Mouser Part Number: 726-IM828XCCXKMA1; Mouser Price/Stock: https://www.mouser.co.uk/ProductDetail/Infineon-Technologies/IM828XCCXKMA1?qs=hWgE7mdIu5TmWfF0vabtqA%3D%3D; Supplier 1: Mouser; Manufacturer Part Number: IM828XCCXKMA1; PartID: 24; Created On: 13.12.2022 10:03:41; ComponentLink1Description: Datasheet; ComponentLink1URL: https://www.infineon.com/dgdl/Infineon-IM828-XCC-DataSheet-v02_01-EN.pdf?fileId=5546d4627448fb2b0174583d4d6d430c; Component Type: Inverter Module; Device Package: DIP 36x23D; Last Updated: 13.12.2022 10:03:41; Manufacturer: Infineon; Mounting Type: THT; Operating Temperature: -40 - 125 °C; Series: CIPOS™ Maxi IM828; Type: Inverter Module; Live Cycle Status: 1; Stock number: not stored
IC6 = LTC6992HS6-4#WTRMPBF: Switching Controllers PWM with 5% to 100% Pulse Width Control; Manufacturer: Analog Devices; Created from: DHufnagel; Manufacturer Part Number: LTC6992HS6-4#WTRMPBF; PartID: 9; Created On: 20.07.2022 14:30:26; ComponentLink1Description: Datasheet; ComponentLink1URL: https://www.mouser.de/datasheet/2/609/LTC6992-1-6992-2-6992-3-6992-4-1852873.pdf; Component Type: Switching Controllers; Device Package: SOT-23-6; Last Updated: 20.07.2022 14:30:26; Mounting Type: SMD; Operating Temperature: -40 - 125°C; Supplier 1: Mouser; Supplier Part Number 1: 584-6992HS64WTRMPBF; Type: Switching Controller; Live Cycle Status: 1; Stock number: not stored
NT1 = Net Tie 2 to 1: Net Tie 2 to 1. Joints two nets without producing a DRC error; PartID: 1; Created On: 26.02.2021 18:37:51; Component Type: Net Tie 2 to 1; Last Updated: 26.02.2021 18:44:55; Type: Net Tie (No BOM); Created by: T. Wendt; Live Cycle Status: 1
R5 R11-R16 = RK73B1JTTD101J: SMD resistor E24 series; Manufacturer: KOA Speer; Tolerance: 5%; Created from: MGremer; Manufacturer Part Number: RK73B1JTTD101J; PartID: 50; Created On: 14.12.2020 16:17:14; ComponentLink1Description: Datasheet; ComponentLink1URL: https://www.mouser.de/datasheet/2/219/RK73B-1825463.pdf; Component Type: SMD resistor; Device Package: 0603; Last Updated: 29.11.2022 14:30:07; Mounting Type: SMD; Supplier 1: Mouser; Supplier Part Number 1: 660-RK73B1JTTD101J; Supplier 2: LCSC; Supplier Part Number 2: C22775; Type: Resistor; Value: 100R; Live Cycle Status: 1; Stock number: Labor SMD Container; LCSC Part Number: C22775
R6 = AC0603FR-1012KL: SMD resistor E24 series 12 kOhms 100mW 0603 1%; Manufacturer: YAGEO; Created from: VStarost; Manufacturer Part Number: AC0603FR-1012KL; PartID: 257; Created On: 10.02.2023 10:27:45; ComponentLink1Description: Datasheet; ComponentLink1URL: https://www.mouser.de/datasheet/2/447/PYu_AC_51_RoHS_L_9-3005297.pdf; Component Type: SMD resistor; Device Package: 0603; Last Updated: 15.02.2023 17:38:28; Mounting Type: SMD; Supplier 1: Mouser; Supplier Part Number 1: 603-AC0603FR-1012KL; Type: Resistor; Value: 12k; Live Cycle Status: 1; Stock number: not stored; LCSC Part Number: C844123
R7 = RC0603FR-10470KL: SMD resistor E24 series 470 kOhms 100-200 mW 0603 1%; Manufacturer: YAGEO; Created from: VStarost; Manufacturer Part Number: RC0603FR-10470KL; PartID: 258; Created On: 10.02.2023 10:29:56; ComponentLink1Description: Datasheet; ComponentLink1URL: https://www.mouser.de/datasheet/2/447/PYu_RC_Group_51_RoHS_L_11-1984063.pdf; Component Type: SMD resistor; Device Package: 0603; Last Updated: 15.02.2023 17:51:10; Mounting Type: SMD; Supplier 1: Mouser; Supplier Part Number 1: 603-RC0603FR-10470KL; Type: Resistor; Value: 470k; Live Cycle Status: 1; Stock number: not stored; LCSC Part Number: C294664
R8 = ERJ-6ENF2873V: SMD resistor 1%; Manufacturer: Panasonic; Created from: MGremer; Manufacturer Part Number: ERJ-6ENF2873V; PartID: 154; Created On: 14.12.2020 16:17:14; ComponentLink1Description: Datasheet; ComponentLink1URL: https://www.mouser.de/datasheet/2/315/AOA0000C304-1149620.pdf; Component Type: SMD resistor; Device Package: 0805; Last Updated: 15.02.2023 18:07:29; Mounting Type: SMD; Supplier 1: Mouser; Supplier Part Number 1: 667-ERJ-6ENF2873V; Type: Resistor; Tolerance: 1%; Value: 287k; Live Cycle Status: 1; Stock number: not stored; LCSC Part Number: C228683
R9 = CR0603-FX-9763ELF: SMD resistor 1%, 50V, 100ppm; Manufacturer: Bourns; Created from: DHufnagel; Manufacturer Part Number: CR0603-FX-9763ELF; PartID: 234; Created On: 25.07.2022 08:26:35; ComponentLink1Description: Datasheet; ComponentLink1URL: https://www.mouser.de/datasheet/2/54/cr-1858361.pdf; Component Type: SMD resistor; Device Package: 0603; Last Updated: 15.02.2023 18:14:05; Mounting Type: SMD; Supplier 1: Mouser; Supplier Part Number 1: 652-CR0603FX-9763ELF; Type: Resistor; Tolerance: 1%; Value: 976k; Live Cycle Status: 1; Stock number: not stored; LCSC Part Number: C162980
R10 = CR0603-FX-1823ELF: SMD resistor 1%, 50V, 100ppm; Manufacturer: Bourns; Created from: DHufnagel; Manufacturer Part Number: CR0603-FX-1823ELF; PartID: 235; Created On: 25.07.2022 08:26:35; ComponentLink1Description: Datasheet; ComponentLink1URL: https://www.mouser.de/datasheet/2/54/cr-1858361.pdf; Component Type: SMD resistor; Device Package: 0603; Last Updated: 15.02.2023 18:09:14; Mounting Type: SMD; Supplier 1: Mouser; Supplier Part Number 1: 652-CR0603FX-1823ELF; Type: Resistor; Tolerance: 1%; Value: 182k; Live Cycle Status: 1; Stock number: not stored; LCSC Part Number: C203368
R60 = RK73B1JTTDD392J: as R57 on sheet Power; Manufacturer Part Number: RK73B1JTTDD392J; PartID: 88; Created On: 14.12.2020 16:17:14; ComponentLink1Description: Datasheet; ComponentLink1URL: https://www.mouser.de/datasheet/2/219/RK73B-1825463.pdf; Component Type: SMD resistor; Device Package: 0603; Last Updated: 15.02.2023 17:47:58; Mounting Type: SMD; Supplier 1: Mouser; Supplier Part Number 1: 660-RK73B1JTTDD392J; Type: Resistor; Value: 3k9; Live Cycle Status: 1; Stock number: Labor SMD Container; LCSC Part Number: C177310

## Sheet Current_Measurement_CAS5000.SchDoc
size A4; Author: Veit Starost; CompanyName: Technische Hochschule Nürnberg Georg Simon Ohm; Organization: UltraZohm; Address1: Kesslerplatz 12; Address2: 90489 Nürnberg; Address3: GERMANY; Website: www.ultrazohm.com
Used 4 times, as channels U_Current_Measurement_CAS50001, U_Current_Measurement_CAS50002, U_Current_Measurement_CAS50003, U_Current_Measurement_CAS50004. Parts and nets are listed once, with the designators drawn on the sheet.
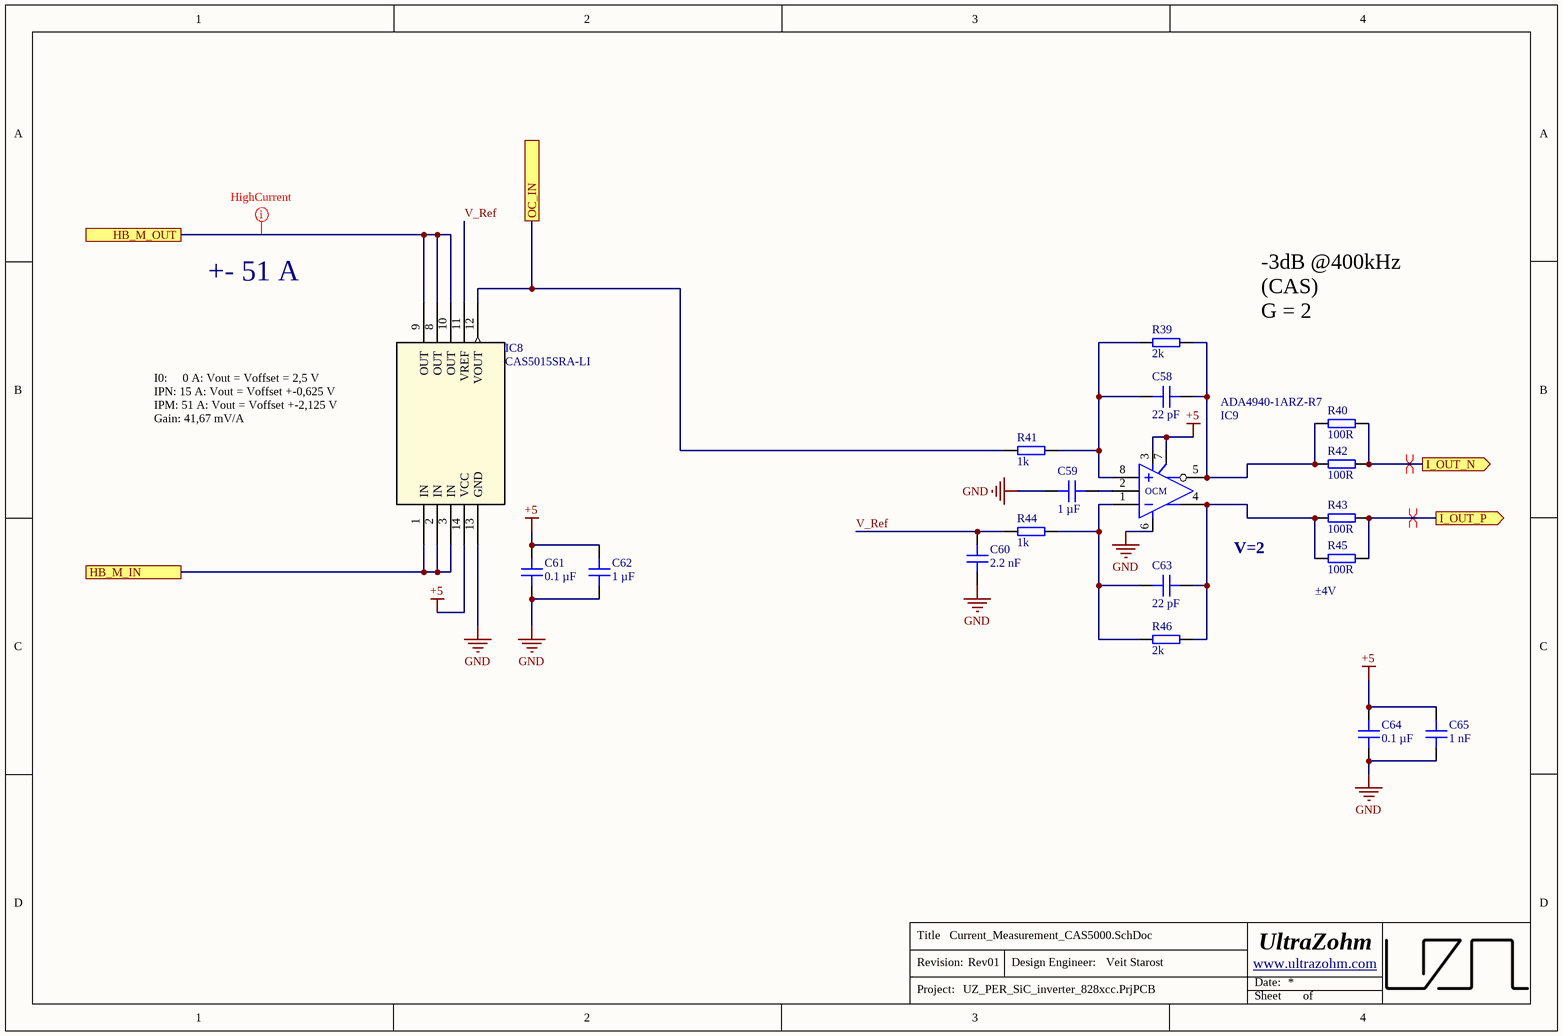
[diagram p3: Current_Measurement_CAS5000.SchDoc]

### Parts
C58  22 pF  [C_0603]
C59  1 µF  [C_0603]
C60  2.2 nF  [C_0603]
C61  0.1 µF  [C_0603]
C62  1 µF  [C_0603]
C63  22 pF  [C_0603]
C64  0.1 µF  [C_0603]
C65  1 nF  [C_0603]
IC8  CAS5015SRA-LI  [CAS50xxSRA]
IC9  ADA4940-1ARZ-R7  [SOIC-8-N]
R39  2k  [RES 0603_1608]
R40  100R  [RES 0603_1608]
R41  1k  [RES 0603_1608]
R42  100R  [RES 0603_1608]
R43  100R  [RES 0603_1608]
R44  1k  [RES 0603_1608]
R45  100R  [RES 0603_1608]
R46  2k  [RES 0603_1608]

### Ports
HB_M_IN, HB_M_OUT, I_OUT_N (out), I_OUT_P (out), OC_IN

### Nets
+5: C61.2 C62.1 C64.2 C65.2 IC8.14(VCC) IC9.3(V+) IC9.7(EN)
GND: C59.1 C60.1 C61.1 C62.2 C64.1 C65.1 IC8.13(GND) IC9.6(V-)
HB_M_IN: IC8.1(IN) IC8.2(IN) IC8.3(IN) ; port HB_M_IN
HB_M_OUT: IC8.8(OUT) IC8.9(OUT) IC8.10(OUT) ; port HB_M_OUT
I_OUT_N: R40.2 R42.2 ; port I_OUT_N
I_OUT_P: R43.2 R45.2 ; port I_OUT_P
OC_IN: IC8.12(VOUT) R41.1 ; port OC_IN
V_Ref: C60.2 IC8.11(VREF) R44.1
NetC58_1: C58.1 IC9.8(+) R39.1 R41.2
NetC58_2: C58.2 IC9.5(Out) R39.2 R40.1 R42.1
NetC59_2: C59.2 IC9.2(OCM)
NetC63_1: C63.1 IC9.1(-) R44.2 R46.1
NetC63_2: C63.2 IC9.4(Out) R43.1 R45.1 R46.2

### Channels
U_Current_Measurement_CAS50001: designators end in A; ports HB_M_IN=I_IN1 HB_M_OUT=I_M_OUT1 I_OUT_N=I_OUT_N1 I_OUT_P=I_OUT_P1 OC_IN=OC_IN1
U_Current_Measurement_CAS50002: designators end in B; ports HB_M_IN=I_IN2 HB_M_OUT=I_M_OUT2 I_OUT_N=I_OUT_N2 I_OUT_P=I_OUT_P2 OC_IN=OC_IN2
U_Current_Measurement_CAS50003: designators end in C; ports HB_M_IN=I_IN3 HB_M_OUT=I_M_OUT3 I_OUT_N=I_OUT_N3 I_OUT_P=I_OUT_P3 OC_IN=OC_IN3
U_Current_Measurement_CAS50004: designators end in D; ports HB_M_IN=I_IN4 HB_M_OUT=I_M_OUT4 I_OUT_N=I_OUT_N4 I_OUT_P=I_OUT_P4 OC_IN=OC_IN4

### Layout directives
mark named HighCurrent: I_M_OUT1
differential pair: I_OUT_N1, I_OUT_P1

### Notes on the sheet
- +- 51 A
- -3dB @400kHz (CAS)
  G = 2
  VoutP-VoutN= +-5V
- I0:     0 A: Vout = Voffset = 2,5 V
  IPN: 15 A: Vout = Voffset +-0,625 V
  IPM: 51 A: Vout = Voffset +-2,125 V
  Gain: 41,67 mV/A
- V=2
- (near R45) ±4V
- Title
- Revision:
- Design Engineer:
- Date:
- Project:
- Sheet
- of

### Library data of the parts
C58 C63 = C0603C220J5RACTU: Capacitor 0603, 50 VDC, 22 pF, X7R; Manufacturer: KEMET; Tolerance: 5 %; Voltage Rating: 50 VDC; Created from: MGremer; Manufacturer Part Number: C0603C220J5RACTU; PartID: 78; Created On: 20.12.2020 13:54:13; ComponentLink1Description: Datasheet; ComponentLink1URL: https://www.mouser.de/datasheet/2/212/KEM_C1002_X7R_SMD-1102033.pdf; Component Type: Capacitor 0603; Device Package: 0603; Last Updated: 20.01.2021 13:57:36; Mounting Type: SMD; Operating Temperature: -55 - 125°C; Series: SMD Comm X7R; Supplier 1: Mouser; Supplier Part Number 1: 80-C0603C220J5R; Type: Capacitor; Value: 22 pF; Live Cycle Status: 1; Stock number: not stored
C59 C62 = UMK107AB7105KA-T: 50V 1uF X7R ±10% 0603 Multilayer Ceramic Capacitors MLCC - SMD/SMT ROHS; Manufacturer: Taiyo Yuden; Voltage Rating: 50 VDC; Created from: NDiringer; Manufacturer Part Number: UMK107AB7105KA-T; PartID: 98; Created On: 09.08.2022 09:35:02; ComponentLink1Description: Datasheet; ComponentLink1URL: https://www.mouser.de/datasheet/2/396/mlcc02_e-1307760.pdf; Component Type: Capacitor 0603; Device Package: 0603; Last Updated: 21.09.2022 16:11:37; Mounting Type: SMD; Operating Temperature: -55 - 125°C; Series: X7R; Supplier 1: LCSC; Supplier Part Number 1: C105174; Supplier 2: Mouser; Supplier Part Number 2: 963-UMK107AB7105MA-T; Type: Capacitor; Tolerance: 10 %; Value: 1 µF; Live Cycle Status: 1; LCSC Part Number: C105174; Stock number: not stored
C60 = 06035C222JAT2A: Capacitor 0603, 50 VDC, 2.2 nF, X7R; Manufacturer: AVX; Tolerance: 5 %; Voltage Rating: 50 VDC; Created from: MGremer; Manufacturer Part Number: 06035C222JAT2A; PartID: 77; Created On: 20.12.2020 13:54:13; ComponentLink1Description: Datasheet; ComponentLink1URL: https://www.mouser.de/datasheet/2/40/X7RDielectric-777024.pdf; Component Type: Capacitor 0603; Device Package: 0603; Last Updated: 15.02.2023 17:14:22; Mounting Type: SMD; Operating Temperature: -55 - 125°C; Series: MLCC X7R; Supplier 1: Mouser; Supplier Part Number 1: 581-06035C222J; Type: Capacitor; Value: 2.2 nF; Live Cycle Status: 1; Stock number: not stored; Supplier Part Number 2: C86023; Supplier 2: LCSC
C61 C64 = C0603X104K5RAC7411: as C1 on sheet TopSheet; Manufacturer Part Number: C0603X104K5RAC7411; PartID: 3; Created On: 20.12.2020 13:54:13; ComponentLink1Description: Datasheet; ComponentLink1URL: https://www.mouser.de/datasheet/2/212/1/KEM_C1013_X7R_FT_CAP_SMD-1103280.pdf; Component Type: Capacitor 0603; Device Package: 0603; Last Updated: 04.03.2021 09:24:28; Mounting Type: SMD; Operating Temperature: -55 - 125°C; Series: SMD Comm X7R Flex; Supplier 1: Mouser; Supplier Part Number 1: 80-C0603X104K5R7411; Supplier 2: LCSC; Supplier Part Number 2: C14663; Type: Capacitor; Value: 0.1 µF; Live Cycle Status: 1; LCSC Part Number: C14663; Stock number: Labor SMD Container
C65 = CC0603JRNPO9BN102: Capacitor 0603, 50 VDC, 1 nF, NP0; Manufacturer: YAGEO; Tolerance: 5 %; Voltage Rating: 50 VDC; Created from: AGeiger; Manufacturer Part Number: CC0603JRNPO9BN102; PartID: 104; Created On: 30.08.2022 11:46:28; ComponentLink1Description: Datasheet; ComponentLink1URL: https://datasheet.lcsc.com/lcsc/1811021411_YAGEO-CC0603JRNPO9BN102_C106246.pdf; Component Type: Capacitor 0603; Device Package: 0603; Last Updated: 30.08.2022 11:46:28; Mounting Type: SMD; Operating Temperature: -55 - 125°C; Series: NP0; Supplier 1: LCSC; Supplier Part Number 1: C106246; Type: Capacitor; Value: 1 nF; Live Cycle Status: 1; LCSC Part Number: C106246
IC8 = CAS5015SRA-LI: 15A, 1.1%, 400kHz; Mfr_Name: LEM; Manufacturer_Part_Number: CASR 15-NP; Manufacturer: Sensitec; Created from: VStarost; Copyright: Copyright (C) 2022 Ultra Librarian. All rights reserved.; Digi-Key_Part_Number_1: 398-1092-5-ND; Digi-Key_Part_Number_2: 398-1092-5-NDL; Digi-Key_Part_Number_3: 398-1092-ND; RefDes: RefDes; Type: Current Sensor; Manufacturer Part Number: CAS5015SRA-LI; PartID: 3; Created On: 10.02.2023 10:35:26; ComponentLink1Description: Datasheet; ComponentLink1URL: https://www.sensitec.com/fileadmin/sensitec/Service_and_Support/Downloads/Data_Sheets/CAS5000/SENSITEC_CAS5000-Series_DSE_01.pdf; Component Type: TMR-Current Sensor; Device Package: THT; Last Updated: 10.02.2023 10:35:26; Mounting Type: THT; Operating Temperature: -40 - 105°C; Series: CAS5000; Supplier 1: RS; Supplier Part Number 1: 216-9746; Value: 15A; Live Cycle Status: 1; Stock number: not stocked
IC9 = ADA4940-1ARZ-R7: Differential ADC Driver; Manufacturer: Analog Devices; Class I: Analog; Class II: Fully Differential ADC Drivers (-40-125°C); Best.-Nr.: Farnell 209-6178; Channels: 1; Created from: MGremer; Datasheet: DSO11449, Ver. Aug 2000; Last edited: 04.01.2007 10:14; Package Reference: SOIC-N-8; Manufacturer Part Number: ADA4940-1ARZ-R7; PartID: 3; Created On: 15.01.2021 12:16:53; ComponentLink1Description: Datasheet; ComponentLink1URL: https://www.mouser.de/datasheet/2/609/ADA4940-1_4940-2-878284.pdf; Component Type: ADC; Device Package: SOIC-8; Last Updated: 22.11.2021 15:19:18; Mounting Type: SMD; Operating Temperature: -40 - 105 °C; Supplier 1: Mouser; Supplier Part Number 1: 584-ADA4940-1ARZ-R7; Type: ADC; Resolution: -; Value: differential ADC driver; Live Cycle Status: 1; Stock number: not stored
R39 R46 = ERA-3VEB2001V: SMD resistor 0.1%; Manufacturer: Panasonic; Created from: MGremer; Manufacturer Part Number: ERA-3VEB2001V; PartID: 187; Created On: 14.12.2020 16:17:14; ComponentLink1Description: Datasheet; ComponentLink1URL: https://www.mouser.de/datasheet/2/315/Panasonic_Resistor_Thin_Film_(ERA-xV_2c_ERA-xK_Ser-1815278.pdf; Component Type: SMD resistor; Device Package: 0603; Last Updated: 15.02.2023 17:45:34; Mounting Type: SMD; Supplier 1: Mouser; Supplier Part Number 1: 667-ERA-3VEB2001V; Type: Resistor; Tolerance: 0.1%; Value: 2k; Live Cycle Status: 1; Stock number: not stored; LCSC Part Number: C318130
R40 R42 R43 R45 = RK73B1JTTD101J: as R5 on sheet IM828XCC; Manufacturer Part Number: RK73B1JTTD101J; PartID: 50; Created On: 14.12.2020 16:17:14; ComponentLink1Description: Datasheet; ComponentLink1URL: https://www.mouser.de/datasheet/2/219/RK73B-1825463.pdf; Component Type: SMD resistor; Device Package: 0603; Last Updated: 29.11.2022 14:30:07; Mounting Type: SMD; Supplier 1: Mouser; Supplier Part Number 1: 660-RK73B1JTTD101J; Supplier 2: LCSC; Supplier Part Number 2: C22775; Type: Resistor; Value: 100R; Live Cycle Status: 1; Stock number: Labor SMD Container; LCSC Part Number: C22775
R41 R44 = RC0603FR-071KL: SMD resistor 1%; Manufacturer: YAGEO; Created from: MGremer; Manufacturer Part Number: RC0603FR-071KL; PartID: 177; Created On: 14.12.2020 16:17:14; ComponentLink1Description: Datasheet; ComponentLink1URL: http://www.farnell.com/datasheets/2860681.pdf; Component Type: SMD resistor; Device Package: 0603; Last Updated: 15.02.2023 17:36:12; Mounting Type: SMD; Supplier 1: Farnell; Supplier Part Number 1: 9238484; Type: Resistor; Tolerance: 1%; Value: 1k; Live Cycle Status: 1; Stock number: not stored; LCSC Part Number: C3016283